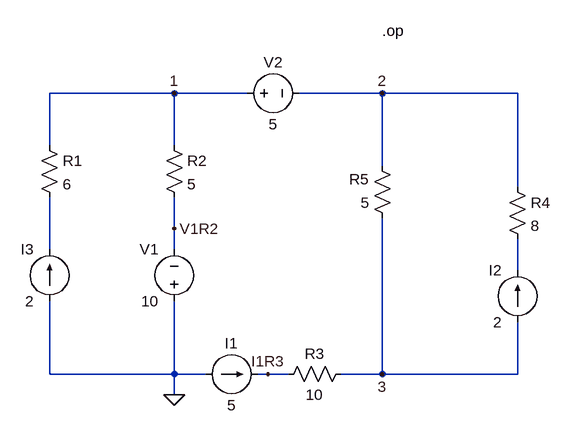
[diagram p0: schematic Draft1.asc]
Draft1.asc, the LTspice schematic file:
Version 4
SHEET 1 880 680
WIRE 112 32 -80 32
WIRE 224 32 112 32
WIRE 432 32 304 32
WIRE 640 32 432 32
WIRE -80 112 -80 32
WIRE 112 112 112 32
WIRE 432 144 432 32
WIRE 640 176 640 32
WIRE 112 240 112 192
WIRE -80 272 -80 192
WIRE 112 272 112 240
WIRE 640 304 640 256
WIRE -80 464 -80 352
WIRE 112 464 112 352
WIRE 112 464 -80 464
WIRE 160 464 112 464
WIRE 256 464 240 464
WIRE 288 464 256 464
WIRE 432 464 432 224
WIRE 432 464 368 464
WIRE 640 464 640 384
WIRE 640 464 432 464
WIRE 112 496 112 464
FLAG 112 32 1
FLAG 432 32 2
FLAG 432 464 3
FLAG 112 496 0
FLAG 112 240 V1R2
FLAG 256 464 I1R3
SYMBOL res -96 96 R0
SYMATTR InstName R1
SYMATTR Value 6
SYMBOL res 96 96 R0
SYMATTR InstName R2
SYMATTR Value 5
SYMBOL voltage 112 368 R180
WINDOW 0 24 96 Left 2
WINDOW 3 24 16 Left 2
SYMATTR InstName V1
SYMATTR Value 10
SYMBOL current 160 464 R270
WINDOW 0 32 40 VTop 2
WINDOW 3 -32 40 VBottom 2
SYMATTR InstName I1
SYMATTR Value 5
SYMBOL res 384 448 R90
WINDOW 0 0 56 VBottom 2
WINDOW 3 32 56 VTop 2
SYMATTR InstName R3
SYMATTR Value 10
SYMBOL voltage 208 32 R270
WINDOW 0 32 56 VTop 2
WINDOW 3 -32 56 VBottom 2
SYMATTR InstName V2
SYMATTR Value 5
SYMBOL res 624 160 R0
SYMATTR InstName R4
SYMATTR Value 8
SYMBOL current 640 384 R180
WINDOW 0 24 80 Left 2
WINDOW 3 24 0 Left 2
SYMATTR InstName I2
SYMATTR Value 2
SYMBOL current -80 352 R180
WINDOW 0 24 80 Left 2
WINDOW 3 24 0 Left 2
SYMATTR InstName I3
SYMATTR Value 2
SYMBOL res 448 240 R180
WINDOW 0 36 76 Left 2
WINDOW 3 36 40 Left 2
SYMATTR InstName R5
SYMATTR Value 5
TEXT 432 -64 Left 2 !.op

The netlist it stands for:
* Draft1.asc
R1 1 N001 6
R2 1 V1R2 5
V1 0 V1R2 10
I1 0 I1R3 5
R3 3 I1R3 10
V2 1 2 5
R4 2 N002 8
I2 3 N002 2
I3 0 N001 2
R5 3 2 5
.op
.backanno
.end